# EAGLE design FOM5000 (EAGLE 8.1.0)
PART_NUM: 5000; REV: A; TITLE: Feed-O-Matic 5000
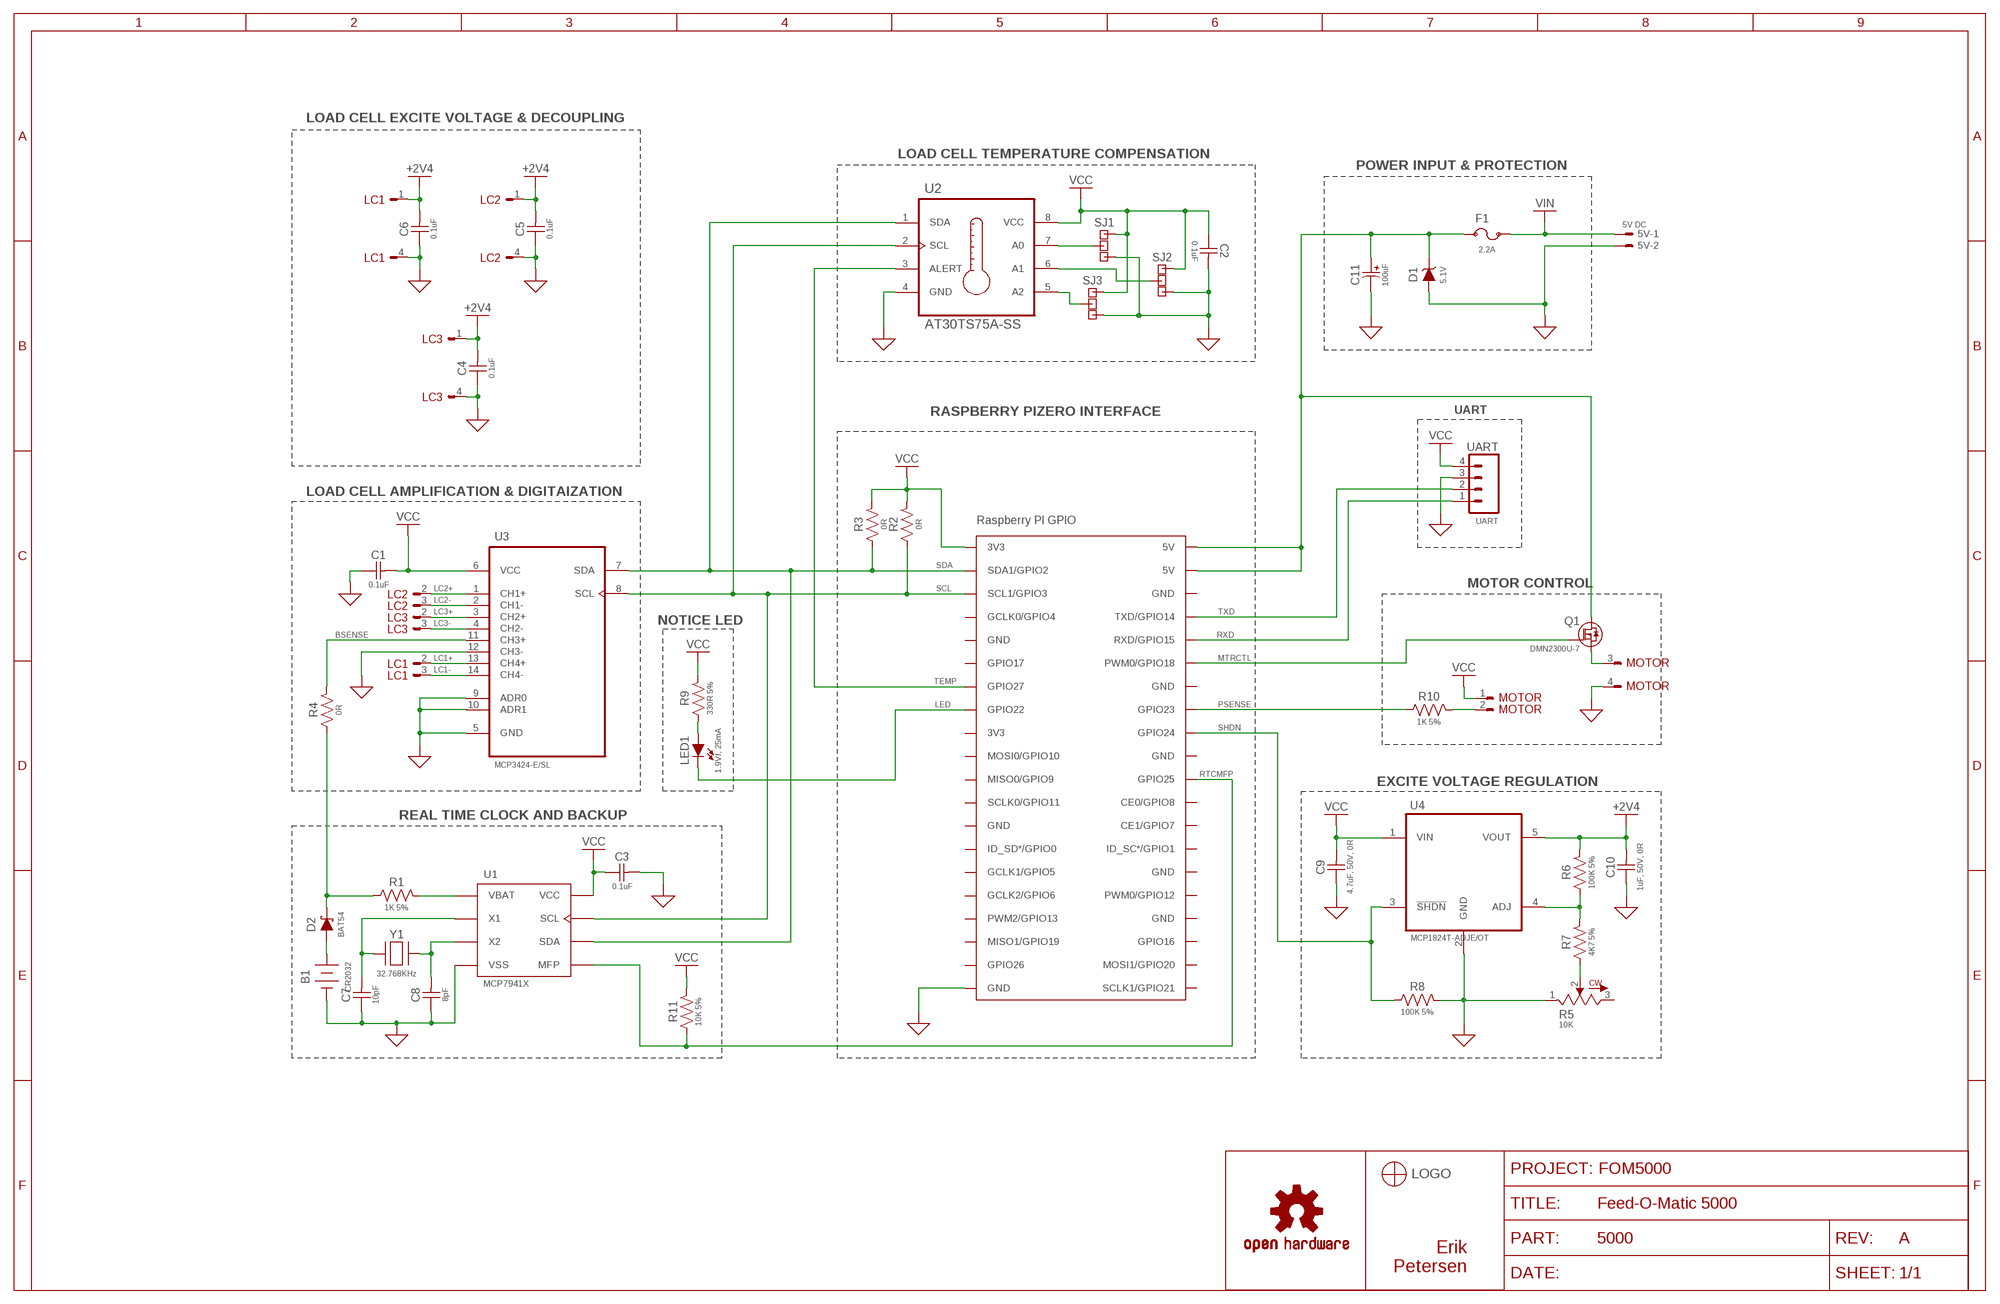
[diagram p0: schematic, sheet 1]

## Parts
5V  5V DC  PTS1_5/2-5_0-HNOIND  [PTS1_5/2-5_0-H-NOIND]
B1  CR2032  BU2032SM-HD-G  [BU2032SM-HD]
C1  0.1uF  GRM188R71E104KA01  [18-0603]
C2  0.1uF  GRM188R71E104KA01  [18-0603]
C3  0.1uF  GRM188R71E104KA01  [18-0603]
C4  0.1uF  GRM188R71E104KA01  [18-0603]
C5  0.1uF  GRM188R71E104KA01  [18-0603]
C6  0.1uF  GRM188R71E104KA01  [18-0603]
C7  10pF  GRM1885C1H100JA01  [18-0603]
C8  8pF  GRM1885C1H8R0DZ01  [18-0603]
C9  4.7uF, 50V, 0R  GRM31CR71H475KA12L  [31-1206]
C10  1uF, 50V, 0R  GRM21BR71H105KA12L  [21-0805]
C11  100uF  UWT0G102MNL1GS/8  [8MM_SMD]
D1  5.1V  CZRB5338B-HF  [DO-214AA]
D2  BAT54  [SOT23-3]
F1  2.2A  1206L110-C  [1206]
LC1  B4B-PH-K-S  [B4B-PH-K-S]
LC2  B4B-PH-K-S  [B4B-PH-K-S]
LC3  B4B-PH-K-S  [B4B-PH-K-S]
LED1  1.9Vf, 25mA  LED5MM  [LED5MM]
LOGO  REDDOG-LOGOSILK  [REDDOG-LOGO-SILK]
LOGO1  OSHW-LOGOL  [OSHW-LOGO-L]
MOTOR  B4B-PH-K-S  [B4B-PH-K-S]
PI  RPI2  [100-2X20-TH-040]
Q1  DMN2300U-7  [SOT23-3]
R1  1K 5%  ERJ-3GEYJ102  [R0603]
R2  0R  ERJ-3GEY0R00  [R0603]
R3  0R  ERJ-3GEY0R00  [R0603]
R4  0R  ERJ-3GEY0R00  [R0603]
R5  10K  3296W-1-103_TRIMPOT  [3296W]
R6  100K 5%  ERJ-3GEYJ104  [R0603]
R7  4K7 5%  ERJ-3GEYJ472  [R0603]
R8  100K 5%  ERJ-3GEYJ104  [R0603]
R9  330R 5%  ERJ-3GEYJ331  [R0603]
R10  1K 5%  ERJ-3GEYJ102  [R0603]
R11  10K 5%  ERJ-3GEYJ103  [R0603]
SJ1  SOLDERJUMPER_2WAYPASTE2&3  [SJ_3_PASTE2&3]
SJ2  SOLDERJUMPER_2WAYPASTE2&3  [SJ_3_PASTE2&3]
SJ3  SOLDERJUMPER_2WAYPASTE2&3  [SJ_3_PASTE2&3]
U1  MCP7941X  [SOIC8-N_MC]
U2  AT30TS75A-SS  [SOIC8-N_MC]
U3  MCP3424-E/SL  [SOIC127P600X175-14N]
U4  MCP1824T-ADJE/OT  [SOT95P270X145-5N]
UART  UART  M04PTH  [100-1X04-TH-040]
Y1  32.768KHz  CM200C32768DZBT  [4-SOJ]

## Nets
5V: C11.P(POS) D1.C F1.1 PI.2(5V) PI.4(5V) Q1.3(D)
+2V4: C4.2 C5.2 C6.2 C10.2 LC1.1 LC2.1 LC3.1 R6.2 U4.5(VOUT)
ADJ: R6.1 R7.2 U4.4(ADJ)
BSENSE: R4.2 U3.11(CH3+)
GND: 5V.2 B1.N(GND) C1.1 C2.2 C3.2 C4.1 C5.1 C6.1 C7.1 C8.1 C9.1 C10.1 C11.N(NEG) D1.A LC1.4 LC2.4 LC3.4 MOTOR.4 PI.39(GND) R5.1 R8.2 SJ1.3 SJ2.3 SJ3.3 U1.4(VSS) U2.4(GND) U3.5(GND) U3.9(ADR0) U3.10(ADR1) U3.12(CH3-) U4.2(GND) UART.3
LC1+: LC1.2 U3.13(CH4+)
LC1-: LC1.3 U3.14(CH4-)
LC2+: LC2.2 U3.1(CH1+)
LC2-: LC2.3 U3.2(CH1-)
LC3+: LC3.2 U3.3(CH2+)
LC3-: LC3.3 U3.4(CH2-)
LED: LED1.K(C) PI.15(GPIO22)
MTRCTL: PI.12(PWM0/GPIO18) Q1.1(G)
N$2: D2.C R1.1 R4.1
N$15: R5.2 R7.1
N$18: LED1.A R9.1
N$21: MOTOR.2 R10.2
N$22: MOTOR.3 Q1.2(S)
PSENSE: PI.16(GPIO23) R10.1
RTCMFP: PI.22(GPIO25) R11.1 U1.7(MFP)
RXD: PI.10(RXD/GPIO15) UART.1
SCL: PI.5(SCL1/GPIO3) R2.1 U1.6(SCL) U2.2(SCL) U3.8(SCL)
SDA: PI.3(SDA1/GPIO2) R3.1 U1.5(SDA) U2.1(SDA) U3.7(SDA)
SHDN: PI.18(GPIO24) R8.1 U4.3(!SHDN)
TA0: SJ1.2 U2.7(A0)
TA1: SJ2.2 U2.6(A1)
TA2: SJ3.2 U2.5(A2)
TEMP: PI.13(GPIO27) U2.3(ALERT)
TXD: PI.8(TXD/GPIO14) UART.2
VBAT: B1.P(VBAT) D2.A
VBAT_IN: R1.2 U1.3(VBAT)
VCC: C1.2 C2.1 C3.1 C9.2 MOTOR.1 PI.1(3V3) R2.2 R3.2 R9.2 R11.2 SJ1.1 SJ2.1 SJ3.1 U1.8(VCC) U2.8(VCC) U3.6(VCC) U4.1(VIN) UART.4
VIN: 5V.1 F1.2
Y1: C7.2 U1.1(X1) Y1.1(A)
Y2: C8.2 U1.2(X2) Y1.4(B)
Unconnected: PI.7(GCLK0/GPIO4) PI.11(GPIO17) PI.17(3V3) PI.19(MOSI0/GPIO10) PI.21(MISO0/GPIO9) PI.23(SCLK0/GPIO11) PI.24(CE0/GPIO8) PI.26(CE1/GPIO7) PI.27(ID_SD*/GPIO0) PI.28(ID_SC*/GPIO1) PI.29(GCLK1/GPIO5) PI.31(GCLK2/GPIO6) PI.32(PWM0/GPIO12) PI.33(PWM2/GPIO13) PI.35(MISO1/GPIO19) PI.36(GPIO16) PI.37(GPIO26) PI.38(MOSI1/GPIO20) PI.40(SCLK1/GPIO21) R5.3

## Notes on the sheet
- LOAD CELL EXCITE VOLTAGE & DECOUPLING
- LOAD CELL TEMPERATURE COMPENSATION
- POWER INPUT & PROTECTION
- RASPBERRY PIZERO INTERFACE | UART
- LOAD CELL AMPLIFICATION & DIGITAIZATION
- MOTOR CONTROL
- NOTICE LED
- EXCITE VOLTAGE REGULATION
- REAL TIME CLOCK AND BACKUP

## Power pins joined to a net without a drawn wire
GND: PI.6(GND) PI.9(GND) PI.14(GND) PI.20(GND) PI.25(GND) PI.30(GND) PI.34(GND)

## Library data of the parts
5V = C3-Connector:PTS1_5/2-5_0-H: PHEONIX PTS 1,5/2-5,0-H PCB Terminal Block - 2 Position - 5.0mm Pitch - Spring Cage
B1 = C3-Battery:BU2032SM-HD-G: MPD SMT CR2032 Battery Holder Datasheet <http://www.memoryprotectiondevices.com/datasheets/BU2032SM-HD-G-datasheet.pdf> Digikey Catalog <https://www.digikey.ca/product-detail/en/mpd-memory-protection-devices/BU2032SM-HD-G/BU2032SM-HD-GCT-ND/755451>
C1-C6 = C3-Murata:GRM18*: Murata Chip Capacitor 0603 Size; SIZE: 0603; TEMPCO: X7R; TOLERANCE: ±10%; VOLTAGE: 25V
C7 = C3-Murata:GRM18*: Murata Chip Capacitor 0603 Size; SIZE: 0603; TEMPCO: C0G,NP0; TOLERANCE: ±5%; VOLTAGE: 50V
C8 = C3-Murata:GRM18*: Murata Chip Capacitor 0603 Size; SIZE: 0603; TEMPCO: C0G,NP0; TOLERANCE: ±0.5pF; VOLTAGE: 50V
C9 = C3-Murata:GRM31CR71H475KA12L; CAP: 4.7E-6; ESR: 0.0; IRMS: 0.0; MANUFACTURER_NAME: MuRata; MANUFACTURER_PART_NUMBER: GRM31CR71H475KA12L; VDC: 50.0; VENDOR: MuRata
C10 = C3-Murata:GRM21BR71H105KA12L; CAP: 1.0E-6; ESR: 0.0; IRMS: 0.0; MANUFACTURER_NAME: MuRata; MANUFACTURER_PART_NUMBER: GRM21BR71H105KA12L; VDC: 50.0; VENDOR: MuRata
C11 = C3-Nichicon:UWT*M?: Wide Temperature Range Aluminum Eletrolytic Capacitor SMD Datasheet <http://nichicon-us.com/english/products/pdfs/e-uwt.pdf> Highlights: Wide Temperature Range: -55°C-105°C Small, Low profile 4-50VDC 1-1500µF ± 20% Nichicon doesn't use specific codes for sizes, some such as CL1GB can be 4, 5 or 6.3mm. The diameter is appended to the package like /size but note it's not part of the actual part number.; HEIGHT: 10mm
D1 = C3-Comchip:CZRB*?: Comchip 5W SMD Zener Diode Datasheet <http://www.comchiptech.com/cms/UserFiles/CZRB5338B-HF%20Thru111480.%20CZRB5388B-HF%20RevA.pdf> Digikey Catalog <https://www.digikey.ca/products/en/discrete-semiconductor-products/diodes-zener-single/287?k=&pkeyword=&pv588=4&FV=fffc0281%2Cffe0011f%2C1140003&mnonly=0&newproducts=0&ColumnSort=0&page=1&quantity=0&ptm=0&fid=0&pageSize=25>; VZ: 5.1; ZMAX: 1.5
D2 = C3-RCL:BAT54: FAIRCHILD SINGLE SCHOTTKY DIODE
F1 = C3-Littelfuse:1206L*: POLYFUSE® Resettable PTCs 1206L Series; I-HOLD: 1.1A
LC1-LC3 MOTOR = C3-JST:B4B-PH-K-S
LED1 = C3-LED:LED: Generic LED
LOGO = C3-General:REDDOG-LOGO: Red Dog Logo
LOGO1 = C3-General:OSHW-LOGO: Open Source Hardware Logo This logo indicates the piece of hardware it is found on incorporates a OSHW license and/or adheres to the definition of open source hardware found here: http://freedomdefined.org/OSHW
PI = C3-Modules:RPI2: Device for Raspberry Pi GPIO Header
Q1 = C3-General:DMN2300U-?: Diodes Single N-Channel Enhancement Mode MOSFET with Gate protection, SMD
R1-R4 R6-R11 = C3-Panasonic:ERJ-?*: Panasonic ERJ Thick Film Chip Resistor
R5 = C3-Bourns:3296?-1-*_TRIMPOT: Bourns 3296 Multiturn Trimpot Datasheet <http://www.bourns.com/pdfs/3296.pdf>; RESISTANCE: 10K
SJ1-SJ3 = C3-General:SOLDERJUMPER_2WAY: Solder Jumper 2 way solder jumper
U1 = C3-Microchip:MCP7941X: MCP7941X I2C Real-Time Clock/Calendar with EEPROM, SRAM, Unique ID and Battery Switchover
U2 = C3-Microchip:AT30TS75A-?: 9- to 12-bit Selectable, ±0.5°C Accurate, Digital Temperature Sensor - I2C Bus Datasheet <http://www.atmel.com/images/atmel-8839-dts-at30ts75a-datasheet.pdf> Highlghts: Single 1.7V to 5.5V Supply Measures Temperature from -55°C to +125°C Highly Accurate Temperature Measurements Requiring No External Components ±0.5°C Accuracy (Typical) Over the 0°C to +85°C Range ±1.0°C Accuracy (Typical) Over the -25°C to +105°C Range ±2.0°C Accuracy (Typical) Over the -40°C to +125°C Range User-configurable Resolution 9 to 12 bits (0.5°C to 0.0625°C) User-configurable High and Low Temperature Limits ALERT Output Pin for Indicating Temperature Alarms 2-wire I2C and SMBus™ Compatible Serial Interface Supports SMBus Timeout Supports SMBus Alert and Alert Response Address (ARA) Selectable Addressing Allows up to Eight Devices on the Same Bus I2C High-Speed (HS) Mode Compatible 3.4MHz Maximum Clock Frequency Built-in Noise Suppression Filtering for Clock and Data Input Signals Low Power Dissipation 85μA Active Current (Typical) During Temperature Measurements Shutdown Mode to Minimize Power Consumption 1μA Shutdown Current (Typical) One-Shot Mode for Single Temperature Measurement While in Shutdown Mode Pin and Software Compatible to Industry-standard LM75-type Devices
U3 = C3-Microchip:MCP3424-E/SL: Analog-to-Digital Converter; MPN: MCP3424-E/SL; OC_FARNELL: 1630424; OC_NEWARK: 54M4871; PACKAGE: SOIC-14; SUPPLIER: Microchip
U4 = C3-Microchip:MCP1824T-ADJE/OT: Low Quiescent Current LDO Regulator; MPN: MCP1824T-ADJE/OT; OC_FARNELL: 1578393; OC_NEWARK: 40M0692; PACKAGE: SOT-5; SUPPLIER: Microchip
UART = C3-Connector:M04: Header 4 Standard 4-pin 0.1" header. Use with straight break away headers (SKU : PRT-00116), right angle break away headers (PRT-00553), swiss pins (PRT-00743), machine pins (PRT-00117), and female headers (PRT-00115). Molex polarized connector foot print use with SKU : PRT-08231 with associated crimp pins and housings. 1MM SMD Version SKU: PRT-10208
Y1 = C3-General:CM200C32768*: Citizen CM Series 32.768KHz Tuning Fork Crystal All CM series of SMD tuning fork crystals from Citizen are excellent choices for clock sources in small mobile telecommunications devices as well as any portable equipment requiring low power consumption. The CM130 series features a 1.4 x 6.9 x 1.3 mm SMD plastic package with an embedded heat resistant cylinder type crystal. Load capacitance is 12.5 pf. The frequency tolerance is ±20 ppm at25°C with an operating temperature range of -40°C to +85°C. The CM315 series features an ultra-lightweight and miniature 3.3 x 1.6 x 0.9 mm SMD ceramic package. There are load capacitance choices of 7.0, 9.0, and 12.5 pf. There are frequency tolerance choices of ±10 and ±20 ppm at 25°C with an operating temperature range of -40°C to +85°C. The CM415 series features a thin and lightweight 4.2 x 1.6 x 0.9 mm SMD ceramic package. There are load capacitance choices of 7.0, 9.0, and 12.5 pf. There are frequency tolerance choices of ±10 and ±20 ppm at 25°C with an operating temperature range of -40°C to +85°C. The CM519 series features a thin and lightweight 5.1 x 2.0 x 1.0 mm SMD ceramic package. There are load capacitance choices of 7.0, 9.0, and 12.5 pf. There are frequency tolerance choices of ±10 and ±20 ppm at 25°C with an operating temperature range of -40°C to +85°C. The CM200C Series features an 8.0 x 3.8 x 2.55 mm SMD plastic package embedded with a heat resistant cylinder type crystal. There are load capacitance choices of 6.0 and 12.5 pf. There are frequency tolerance choices of ±5, ±10, ±20, and ±30 ppm at 25°C with an operating temperature range of -40°C to +85°C. Product Catalog <https://www.digikey.ca/en/product-highlight/c/citizen-finetech-miyota/cm-series-32khz-crystals>; CL: 6pF

## Board
Feed-O-Matic 5000 PCB Designed by Erik Petersen - Copyright 2017
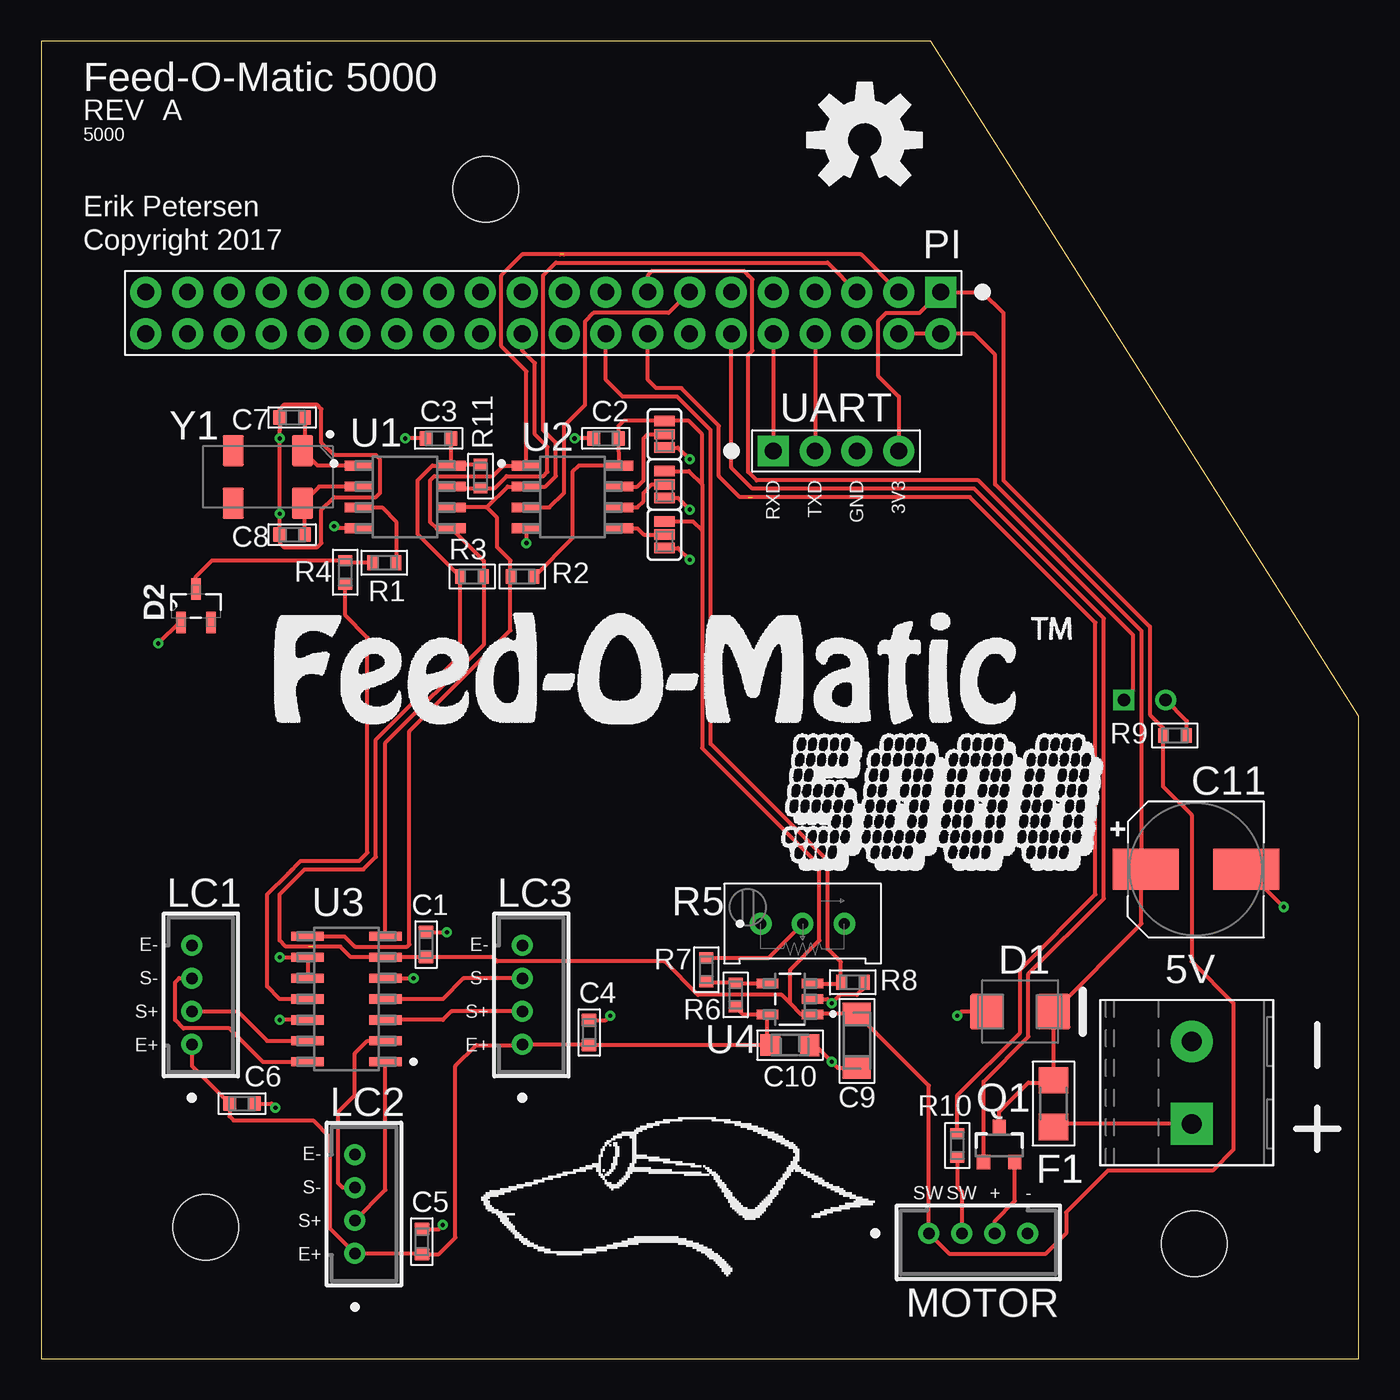
[diagram p1: board, top side]
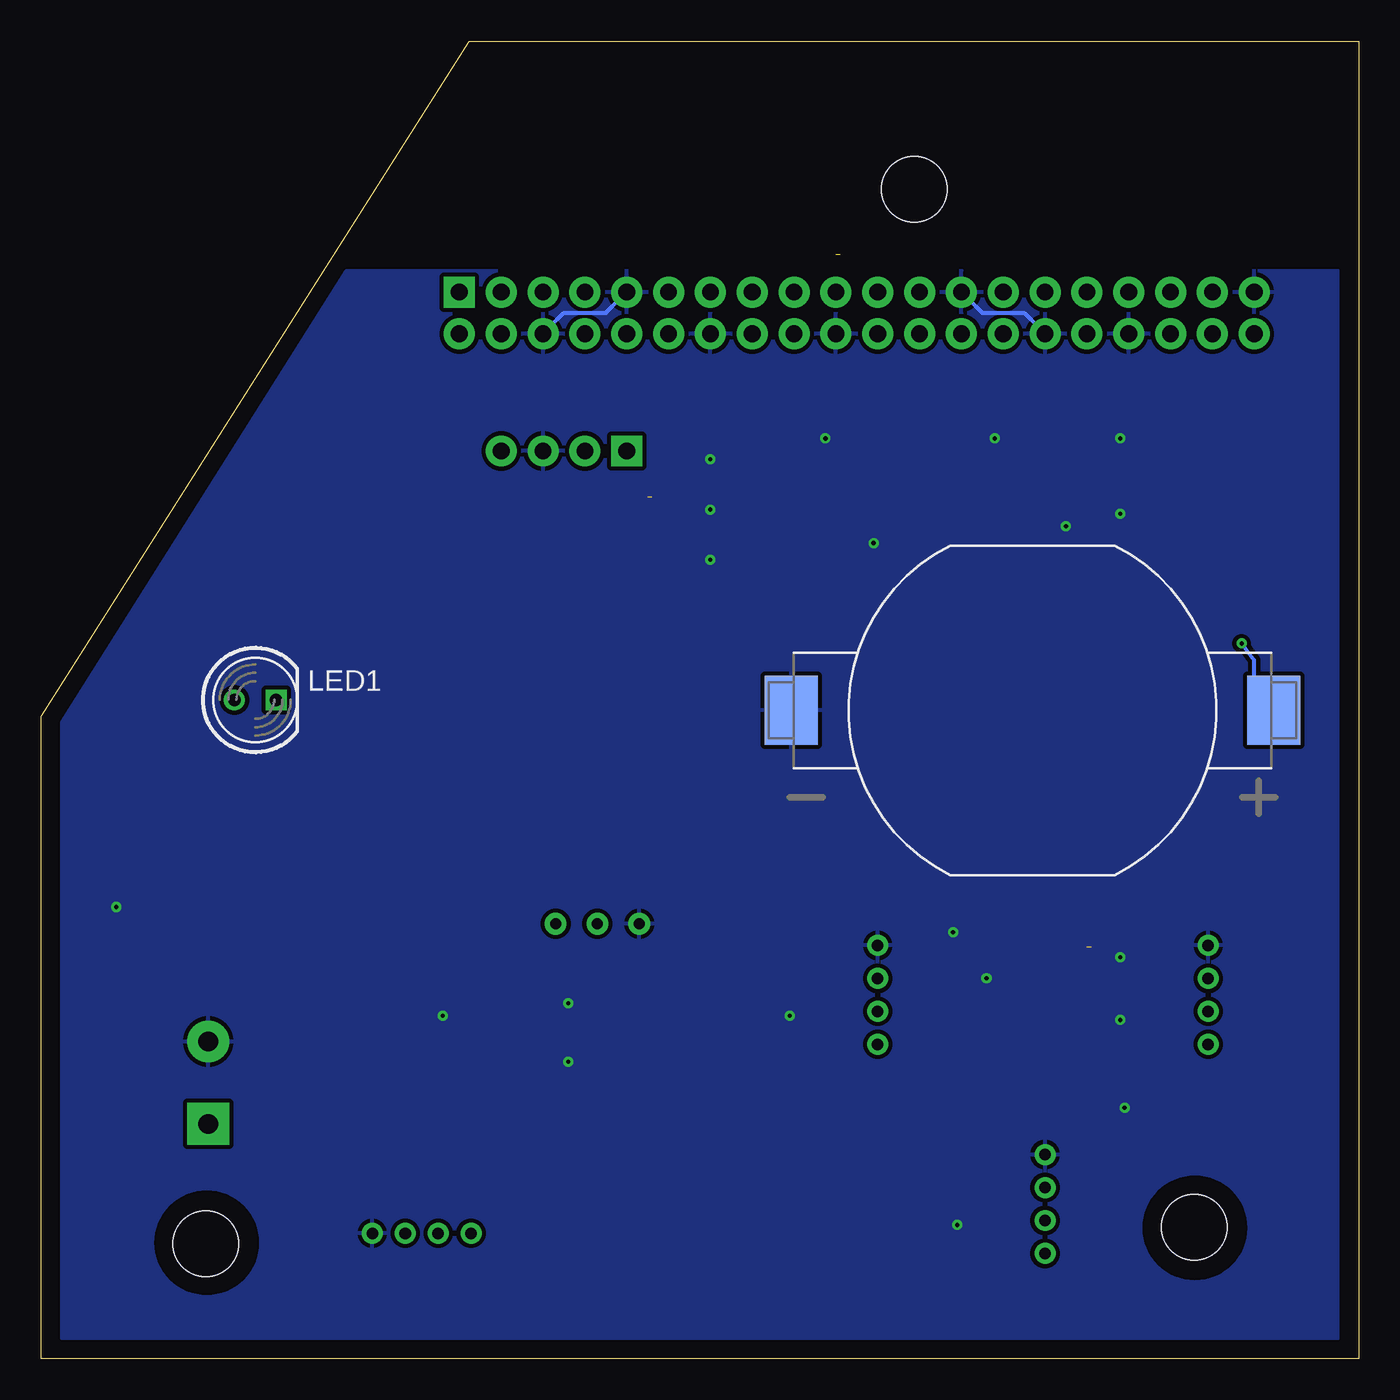
[diagram p2: board, bottom side, seen from below]

Size 80 x 80 mm. Coordinates in mm from the lower left corner, seen from the top.
Outline: 0,0 80,0 80,39 54,80 0,80 0,0
Copper layers (1*16): Top 0.0356mm / dielectric 1.5011mm / Bottom 0.0356mm
Design rules "oshpark-2layer": minimum track width 6mil, minimum drill 13mil, track to track 6mil, track to pad 6mil, pad to pad 6mil, via to via 6mil, smd to smd 6mil, copper to edge 15mil, drill to drill 6mil, minimum pad ring 7mil, minimum via ring 7mil, stop-mask expansion 2.5mil, vias tented up to drill 0mil, thermal gap 10mil
Holes 3.97 mm at 70,7 10,8 27,71 27,71 27,71

### Footprints (pad centres in the part's own frame; a part is rotated, then mirrored left to right if it is on the bottom)
PTS1_5/2-5_0-H-NOIND = drill 1.2 pad 2.54 square: 1 0,-2.5 | drill 1.2 pad 2.54: 2 0,2.5
BU2032SM-HD = smd 3.2 x 4.2: N 14.65,0; P -14.65,0
18-0603 = smd 0.8 x 0.9: 1 -0.75,0; 2 0.75,0
31-1206 = smd 1.3 x 1.7: 1 -1.65,0; 2 1.65,0
21-0805 = smd 1.2 x 1.3: 1 -1.2,0; 2 1.2,0
8MM_SMD = smd 4 x 2.5: N 3.05,0; P -3.05,0
DO-214AA = smd 2.032 x 2.159: A 2.032,0; C -2.032,0
SOT23-3 = smd 1.321 x 0.559: A -1.016,0.914; C 1.016,0; NC -1.016,-0.914
1206 = smd 1.6 x 1.803: 1 -1.422,0; 2 1.422,0
B4B-PH-K-S = drill 0.7 pad 1.27: 1 3,0; 2 1,0; 3 -1,0; 4 -3,0
LED5MM = drill 0.762 pad 1.27: A -1.27,0 | drill 0.762 pad 1.27 square: K 1.27,0
100-2X20-TH-040 = drill 1.016 pad 1.88 square: 1 0,0 | drill 1.016 pad 1.88: 2 0,2.54; 3 2.54,0; 4 2.54,2.54; 5 5.08,0; 6 5.08,2.54; 7 7.62,0; 8 7.62,2.54; 9 10.16,0; 10 10.16,2.54; 11 12.7,0; 12 12.7,2.54; 13 15.24,0; 14 15.24,2.54; 15 17.78,0; 16 17.78,2.54; 17 20.32,0; 18 20.32,2.54; 19 22.86,0; 20 22.86,2.54; 21 25.4,0; 22 25.4,2.54; 23 27.94,0; 24 27.94,2.54; 25 30.48,0; 26 30.48,2.54; 27 33.02,0; 28 33.02,2.54; 29 35.56,0; 30 35.56,2.54; 31 38.1,0; 32 38.1,2.54; 33 40.64,0; 34 40.64,2.54; 35 43.18,0; 36 43.18,2.54; 37 45.72,0; 38 45.72,2.54; 39 48.26,0; 40 48.26,2.54
SOT23-3' = smd 0.8 x 0.9: 1 -0.95,-1; 2 0.95,-1; 3 0,1.1
R0603 = smd 0.65 x 0.9: 1 -0.725,0; 2 0.725,0
3296W = drill 0.66 pad 1.321: 1 -2.54,0; 2 0,0; 3 2.54,0
SJ_3_PASTE2&3 = smd 0.635 x 1.27: 1 -0.813,0; 2 0,0; 3 0.813,0
SOIC8-N_MC = smd 1.75 x 0.6: 1 -2.8,1.905; 2 -2.8,0.635; 3 -2.8,-0.635; 4 -2.8,-1.905; 5 2.8,-1.905; 6 2.8,-0.635; 7 2.8,0.635; 8 2.8,1.905
SOIC127P600X175-14N = smd 1.981 x 0.559: 1 -2.362,3.81; 2 -2.362,2.54; 3 -2.362,1.27; 4 -2.362,0; 5 -2.362,-1.27; 6 -2.362,-2.54; 7 -2.362,-3.81; 8 2.362,-3.81; 9 2.362,-2.54; 10 2.362,-1.27; 11 2.362,0; 12 2.362,1.27; 13 2.362,2.54; 14 2.362,3.81
SOT95P270X145-5N = smd 1.321 x 0.559: 1 -1.372,0.94; 2 -1.372,0; 3 -1.372,-0.94; 4 1.372,-0.94; 5 1.372,0.94
100-1X04-TH-040 = drill 1.016 pad 1.88 square: 1 0,0 | drill 1.016 pad 1.88: 2 2.54,0; 3 5.08,0; 4 7.62,0
4-SOJ = smd 1.9 x 1.3: 1 -1.55,2.15; 2 -1.55,-2.05; 3 1.65,-2.05; 4 1.65,2.15

### Placement (x,y rotation side)
5V  69.85,16.76 0 top
B1  19.81,39.37 180 bottom
C1  23.37,25.15 270 top
C2  34.29,55.88 180 top
C3  24.13,55.88 180 top
C4  33.27,19.81 270 top
C5  23.11,7.11 270 top
C6  12.19,15.49 180 top
C7  15.24,57.15 0 top
C8  15.24,50.04 0 top
C9  49.53,19.3 90 top
C10  45.47,19.05 180 top
C11  70.1,29.72 0 top
D1  59.44,21.08 180 top
D2  9.4,45.72 90 top
F1  61.47,15.49 270 top
LC1  9.14,22.1 270 top
LC2  19.05,9.4 270 top
LC3  29.21,22.1 270 top
LED1  67,40 0 bottom
LOGO  38.86,9.66 0 top
LOGO1  50,74 0 top
MOTOR  56.9,7.62 180 top
PI  54.61,64.77 180 top
Q1  DMN2300U-7  [SOT23-3']  58.17,12.95 0 top
R1  20.83,48.34 0 top
R2  29.21,47.5 0 top
R3  26.16,47.5 180 top
R4  18.46,47.75 270 top
R5  46.23,26.42 0 top
R6  42.16,22.1 270 top
R7  40.39,23.62 270 top
R8  49.28,22.86 0 top
R9  68.83,37.85 180 top
R10  55.63,12.95 270 top
R11  26.67,53.59 90 top
SJ1  37.85,56.13 270 top
SJ2  37.85,53.09 270 top
SJ3  37.85,50.04 270 top
U1  22.1,52.32 0 top
U2  32.26,52.32 0 top
U3  18.54,21.84 180 top
U4  45.47,21.84 180 top
UART  44.45,55.12 0 top
Y1  13.72,53.59 270 top

### Tracks (layer width: path | path; a pad name or v marks a point on that pad's centre or on a via)
5V
  Top 0.254: Q1.3 58.17,14.99 59.94,16.76 61.32,16.76 F1.1 D1.C 66.8,26.42 66.8,29.47 C11.P 66.8,29.97 66.8,44.2 57.91,53.09 57.91,60.96 56.64,62.23 PI.2 PI.4
+2V4
  Top 0.254: LC1.1 9.14,17.79 C6.2 11.44,14.72 11.68,14.48 16.51,14.48 17.53,13.46 17.53,7.92 LC2.1 23.08,6.4 C5.2 24.14,6.36 25.15,7.37 25.15,17.78 26.42,19.05 29.16,19.05 LC3.1 33.24,19.1 C4.2 44.25,19.06 C10.2 44.09,19.22 U4.5 42.63,20.9 R6.2
ADJ
  Top 0.254: U4.4 42.2,22.78 R6.1 40.46,22.82 R7.2
BSENSE
  Top 0.254: U3.11 14.48,21.84 13.72,22.61 13.72,28.19 14.99,29.46 | 14.99,29.46 15.24,29.72 | R4.2 18.46,45.13 19.81,43.78 19.81,30.73 19.3,30.23 15.75,30.23 14.99,29.46
GND  (via drill 0.25 pad 0.51)
  Top 0.254: C7.1 14.49,56.4 v14.48,55.88 | C8.1 14.49,49.52 14.73,49.28 16.76,49.28 17.02,49.53 17.02,51.56 17.78,52.32 20.32,52.32 20.57,52.58 20.57,54.61 20.32,54.86 17.78,54.86 17.02,55.63 17.02,57.66 16.76,57.91 14.73,57.91 14.48,57.66 14.48,57.16 | 14.48,50.05 v14.48,51.31 14.48,55.63 v14.48,55.87 v14.48,55.88 | v14.48,55.88 | U1.4 17.91,50.42 v17.78,50.55 | v14.48,24.38 U3.9 U3.10 | C2.2 v32.38,55.88 | SJ1.3 38.66,55.32 v39.37,54.61 | SJ2.3 38.66,52.27 v39.37,51.56 | SJ3.3 38.66,49.23 v39.37,48.51 | C3.2 v22.1,55.88 | C6.1 13.97,15.49 v14.22,15.24 | C1.1 24.63,25.9 v24.64,25.91 | C5.1 24.12,7.86 v24.38,8.13 | C4.1 34.28,20.56 v34.54,20.83 | U4.2 47.75,21.84 v48.01,21.59 48.51,22.1 49.53,22.1 50,22.57 R8.2 | D1.A 55.88,21.08 v55.63,20.83 | U2.4 v29.46,49.54 v29.46,49.53 | U3.12 v14.48,20.57 | U3.5 v22.61,23.11 | C10.1 46.99,19.05 v48.01,18.03 48.39,17.65 C9.1 | C11.N v75.44,27.43
  Top 0.305: C8.1 14.48,50.05 | 14.48,57.16 C7.1
  Bottom 0.254: PI.6 48.26,63.5 45.72,63.5 PI.9 | PI.25 22.86,63.5 20.32,63.5 PI.30
  pour Bottom (isolate 0.254): 1.27,1.27 1.27,66.04 61.47,66.04 78.74,38.61 78.74,1.27
LC1+
  Top 0.254: LC1.2 11.92,21.1 13.72,19.3 U3.13
LC1-
  Top 0.254: U3.14 13.46,18.03 11.43,20.07 8.64,20.07 8.13,20.57 8.13,22.86 8.38,23.11 9.13,23.11 LC1.3
LC2+
  Top 0.254: LC2.2 20.9,10.25 U3.1
LC2-
  Top 0.254: LC2.3 18.3,10.4 18.03,10.67 18.03,14.99 19.05,16 19.05,18.54 19.81,19.3 U3.2
LC3+
  Top 0.254: LC3.2 24.91,21.1 24.38,20.57 U3.3
LC3-
  Top 0.254: LC3.3 25.64,23.1 24.38,21.84 U3.4
LED
  Top 0.254: LED1.K 66.29,40.56 66.29,43.94 56.9,53.34 43.43,53.34 42.93,53.85 42.93,60.96 43.18,61.21 43.18,65.53 42.93,65.79 42.67,66.04 37.08,66.04 36.83,65.79 PI.15
MTRCTL
  Top 0.254: Q1.1 57.22,16.51 57.22,16.83 59.94,19.56 59.94,23.37 64.52,27.94 64.52,44.96 56.64,52.83 43.18,52.83 41.91,54.1 PI.12
N$1
  cutout Bottom: 9.95,11.12 arc-180 9.95,4.78 arc-180
  cutout Bottom: 69.95,10.22 arc-180 69.95,3.88 arc-180
N$2
  Top 0.254: R1.1 18.6,48.34 R4.1 10.38,48.48 9.4,47.5 D2.C
N$15
  Top 0.254: R7.1 44.16,24.35 R5.2
N$18
  Top 0.254: 68.29,39.98 LED1.A 69.56,38.71 R9.1
N$21
  Top 0.254: R10.2 55.63,10.41 55.9,10.14 MOTOR.2
N$22
  Top 0.254: MOTOR.3 57.9,8.37 59.12,9.59 Q1.2
PSENSE  (1 unrouted)
  Top 0.254: R10.1 55.63,16 59.44,19.81 59.44,23.62 64.01,28.19 64.01,44.7 56.39,52.32 42.93,52.32 | 43.18,52.32 42.42,52.32 41.15,53.59 41.15,56.64 38.86,58.93 37.34,58.93 36.83,59.44 PI.16
RTCMFP
  Top 0.254: PI.22 29.21,61.21 29.97,60.45 29.97,56.13 30.73,55.37 30.73,53.85 30.48,53.59 28.26,53.59 27.54,52.87 R11.1 24.99,52.87 U1.7
RXD
  Top 0.254: PI.10 UART.1
SCL
  Top 0.254: PI.5 47.75,66.55 31.24,66.55 30.48,65.79 30.48,56.39 31.24,55.63 31.24,53.59 30.61,52.96 U2.2 28.32,52.96 27.05,51.69 | 27.05,51.69 U1.6 | U3.8 18.41,25.65 19.05,25.02 22.23,25.02 22.35,25.15 22.35,38.1 27.05,42.8 | 27.05,42.8 27.21,42.96 | 27.05,42.8 28.48,44.23 R2.1 28.48,48.48 27.69,49.28 27.69,51.05 27.05,51.69
SDA  (1 unrouted)
  Top 0.254: PI.3 49.78,67.06 31.5,67.06 | 31.75,67.06 29.21,67.06 27.94,65.79 27.94,61.47 29.46,59.95 U2.1 28.07,54.23 27.43,53.59 23.88,53.59 23.62,53.34 23.62,50.8 24,50.42 U1.5 26.89,48.43 R3.1 26.89,43.4 20.9,37.41 U3.7
SHDN
  Top 0.254: U4.3 48.48,22.78 R8.1 48.55,24.09 47.75,24.89 47.75,30.23 40.64,37.34 40.64,54.61 | 40.64,54.61 40.64,55.12 | 40.64,54.61 40.64,56.39 38.61,58.42 35.31,58.42 34.29,59.44 PI.18
TA0
  Top 0.254: SJ1.2 36.83,56.13 36.58,55.88 36.58,53.34 36.2,52.96 U2.7
TA1
  Top 0.254: SJ2.2 37.08,53.09 36.58,52.58 36.58,52.07 36.2,51.69 U2.6
TA2
  Top 0.254: U2.5 36.2,50.42 36.58,50.04 SJ3.2
TEMP
  Top 0.254: PI.13 38.1,63.5 33.53,63.5 33.02,62.99 33.02,57.91 31.75,56.64 31.75,52.58 30.86,51.69 U2.3
TXD
  Top 0.254: PI.8 UART.2
VBAT  (via drill 0.25 pad 0.51)
  Top 0.254: D2.A 8.38,44.7 v7.11,43.43
  Bottom 0.254: 6.1,40.3 B1.P 6.35,40.56 6.35,42.42 v7.11,43.43
VBAT_IN
  Top 0.254: R1.2 21.55,50.84 20.7,51.69 U1.3
VCC  (1 unrouted)
  Top 0.254: 16.26,25.02 18.16,25.02 18.8,24.38 U3.6 22.85,24.38 C1.2 27.42,24.4 27.69,24.13 37.85,24.13 39.88,22.1 44.96,22.1 45.47,21.59 | 16.51,25.02 14.86,25.02 14.48,25.4 14.48,28.19 16,29.72 19.56,29.72 20.32,30.48 20.32,37.59 25.44,42.71 R3.2 22.86,50.08 22.86,53.34 23.75,54.23 U1.8 | U1.8 24.9,55.86 C3.1 | 45.47,21.59 46.15,20.9 U4.1 46.89,20.95 C9.2 53.9,16.59 MOTOR.1 55.17,6.35 60.96,6.35 62.23,7.62 62.23,8.89 64.77,11.43 71.12,11.43 72.39,12.7 72.39,21.59 69.85,24.13 69.85,33.02 68.11,34.76 R9.2 68.11,38.32 67.31,39.12 67.31,44.45 58.42,53.34 58.42,63.5 57.15,64.77 PI.1 53.34,63.5 51.31,63.5 50.8,62.99 50.8,59.69 52.07,58.42 UART.4 | 45.47,21.59 45.47,23.62 47.24,25.4 47.24,29.97 40.13,37.08 40.13,50.29 | 40.13,53.09 40.13,50.29 | 40.13,53.09 40.13,56.13 39.32,56.95 SJ1.1 35.36,56.95 35.04,56.63 C2.1 U2.8 32.64,54.23 32.26,53.85 32.26,49.82 R2.2 | SJ3.1 39.57,50.85 40.13,50.29 | SJ2.1 39.32,53.9 40.13,53.09 | U1.8 24.99,54.32 R11.2
VIN
  Top 0.254: 5V.1 61.66,14.26 F1.2
Y1
  Top 0.254: U1.1 16.78,54.23 Y1.1 15.99,55.27 C7.2
Y2
  Top 0.254: U1.2 16.88,52.96 Y1.4 15.99,51.82 C8.2

### Text on the board
tPlace: REV | RXD | TXD | GND | 3V3 | E- | E- | S- | S- | S+ | S+ | E+ | E+ | E- | S- | SW | SW | + | - | S+ | E+